# Altium project front_controller_old.PrjPcb
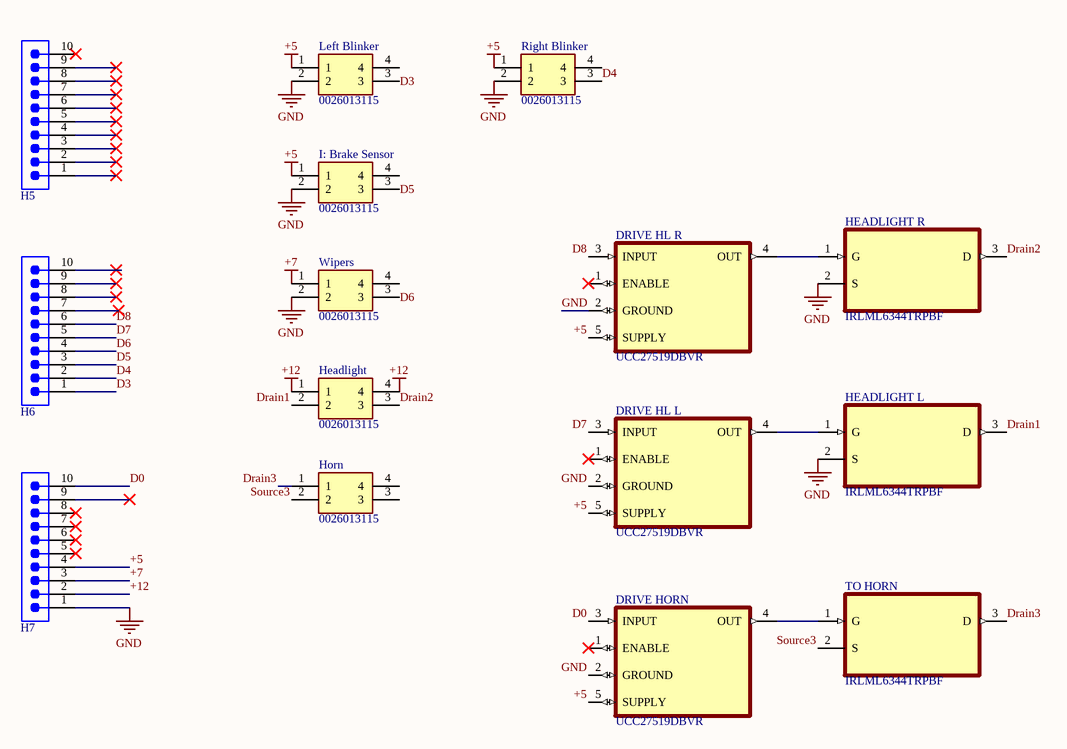
[diagram p0: front_controller.SchDoc]
1 sheet, 15 parts. Net scope: global (net labels, ports and power ports of the same name join across sheets).
Board file: front_controller.PcbDoc

## Sheet front_controller.SchDoc
size A; SheetNumber: 1; SheetTotal: 1

### Parts
DRIVE_HL_L  UCC27519DBVR  [SOT95P280X145-5N]
DRIVE_HL_R  UCC27519DBVR  [SOT95P280X145-5N]
DRIVE_HORN  UCC27519DBVR  [SOT95P280X145-5N]
H5  61301011121  [61301011121]  (value not drawn)
H6  61301011121  [61301011121]  (value not drawn)
H7  61301011121  [61301011121]  (value not drawn)
Headlight  0026013115  [MOLEX_0026013115]
HEADLIGHT_L  IRLML6344TRPBF  [SOT95P240X112-3N]
HEADLIGHT_R  IRLML6344TRPBF  [SOT95P240X112-3N]
Horn  0026013115  [MOLEX_0026013115]
I:_Brake_Sensor  0026013115  [MOLEX_0026013115]
Left_Blinker  0026013115  [MOLEX_0026013115]
Right_Blinker  0026013115  [MOLEX_0026013115]
TO_HORN  IRLML6344TRPBF  [SOT95P240X112-3N]
Wipers  0026013115  [MOLEX_0026013115]

### Nets
+5: DRIVE_HL_L.5(SUPPLY) DRIVE_HL_R.5(SUPPLY) DRIVE_HORN.5(SUPPLY) H7.4 I:_Brake_Sensor.1 Left_Blinker.1 Right_Blinker.1
+7: H7.3 Wipers.1
+12: H7.2 Headlight.1 Headlight.4
GND: DRIVE_HL_L.2(GROUND) DRIVE_HL_R.2(GROUND) DRIVE_HORN.2(GROUND) H7.1 HEADLIGHT_L.2(S) HEADLIGHT_R.2(S) I:_Brake_Sensor.2 Left_Blinker.2 Right_Blinker.2 Wipers.2
D0: DRIVE_HORN.3(INPUT) H7.10
D3: H6.1 Left_Blinker.3
D4: H6.2 Right_Blinker.3
D5: H6.3 I:_Brake_Sensor.3
D6: H6.4 Wipers.3
D7: DRIVE_HL_L.3(INPUT) H6.5
D8: DRIVE_HL_R.3(INPUT) H6.6
Drain1: Headlight.2 HEADLIGHT_L.3(D)
Drain2: Headlight.3 HEADLIGHT_R.3(D)
Drain3: Horn.1 TO_HORN.3(D)
Source3: Horn.2 TO_HORN.2(S)
NetDRIVE_HL_L_4: DRIVE_HL_L.4(OUT) HEADLIGHT_L.1(G)
NetDRIVE_HL_R_4: DRIVE_HL_R.4(OUT) HEADLIGHT_R.1(G)
NetDRIVE_HORN_4: DRIVE_HORN.4(OUT) TO_HORN.1(G)

Not connected (* = marked no-connect by the designer): DRIVE_HL_L 1(ENABLE)*; DRIVE_HL_R 1(ENABLE)*; DRIVE_HORN 1(ENABLE)*; H5 1* 2* 3* 4* 5* 6* 7* 8* 9* 10*; H6 7* 8* 9* 10*; H7 5* 6* 7* 8* 9*; Horn 3 4; I:_Brake_Sensor 4; Left_Blinker 4; Right_Blinker 4; Wipers 4

### Library data of the parts
H5-H7 = 61301011121: WR-PHD Pin Header, THT, Vertical, pitch 2.54mm, 1 Row, 10P; Manufacturer: Wurth Elektronik; Contact Resistance: 20mOhm; Rated Current: 3A; Working Voltage: 250V; Withstanding Voltage: 500V; Manufacturer Part Number: 61301011121; Category: Board-to-Board Connectors; Match Code: WR-PHD; ComponentLink1Description: Website Link; ComponentLink1URL: https://www.we-online.com/redexpert/article/61301011121?ad; ComponentLink2Description: Datasheet Link; ComponentLink2URL: https://www.we-online.com/redexpert/spec/61301011121?ad; Mount: Through Hole; Operating Temperature Max: 105°C; Operating Temperature Min: -40°C; Packaging: Bag; Gender: Pin Header; Number of Pins: 10; Number of Rows: 1; Orientation: Vertical; Pitch: 2.54mm
Headlight Horn I:_Brake_Sensor Left_Blinker Right_Blinker Wipers = 0026013115: Connector Header Through Hole, Right Angle 4 position 0.165 (4.20mm); MF: Molex; Package: None; MP: 0026013115; DigiKey-Purchase-URL: https://snapeda.com/shop?store=DigiKey&id=2597941; Value: *; SnapEDA_Link: https://www.snapeda.com/parts/0026013115/Molex/view-part/2597941/?ref=snap; Price: None; Availability: Unavailable
HEADLIGHT_L HEADLIGHT_R TO_HORN = IRLML6344TRPBF: N-Channel 30V 5A _Ta_ 1.3W _Ta_ Surface Mount Micro3â„¢/SOT-23; MF: Infineon Technologies; Package: SOT-23 Infineon; Value: *; Price: None; MP: IRLML6344TRPBF; Availability: Unavailable; SnapEDA_Link: https://www.snapeda.com/parts/IRLML6344TRPBF/Infineon%20Technologies/view-part/1786730/?ref=snap
DRIVE_HL_L DRIVE_HL_R DRIVE_HORN = UCC27519DBVR: Package: None; Price: None; Value: *; MP: UCC27519DBVR; Availability: Unavailable